# EAGLE design iot_inventory_mote (EAGLE 7.0.0)

## Sheet 1 of 2
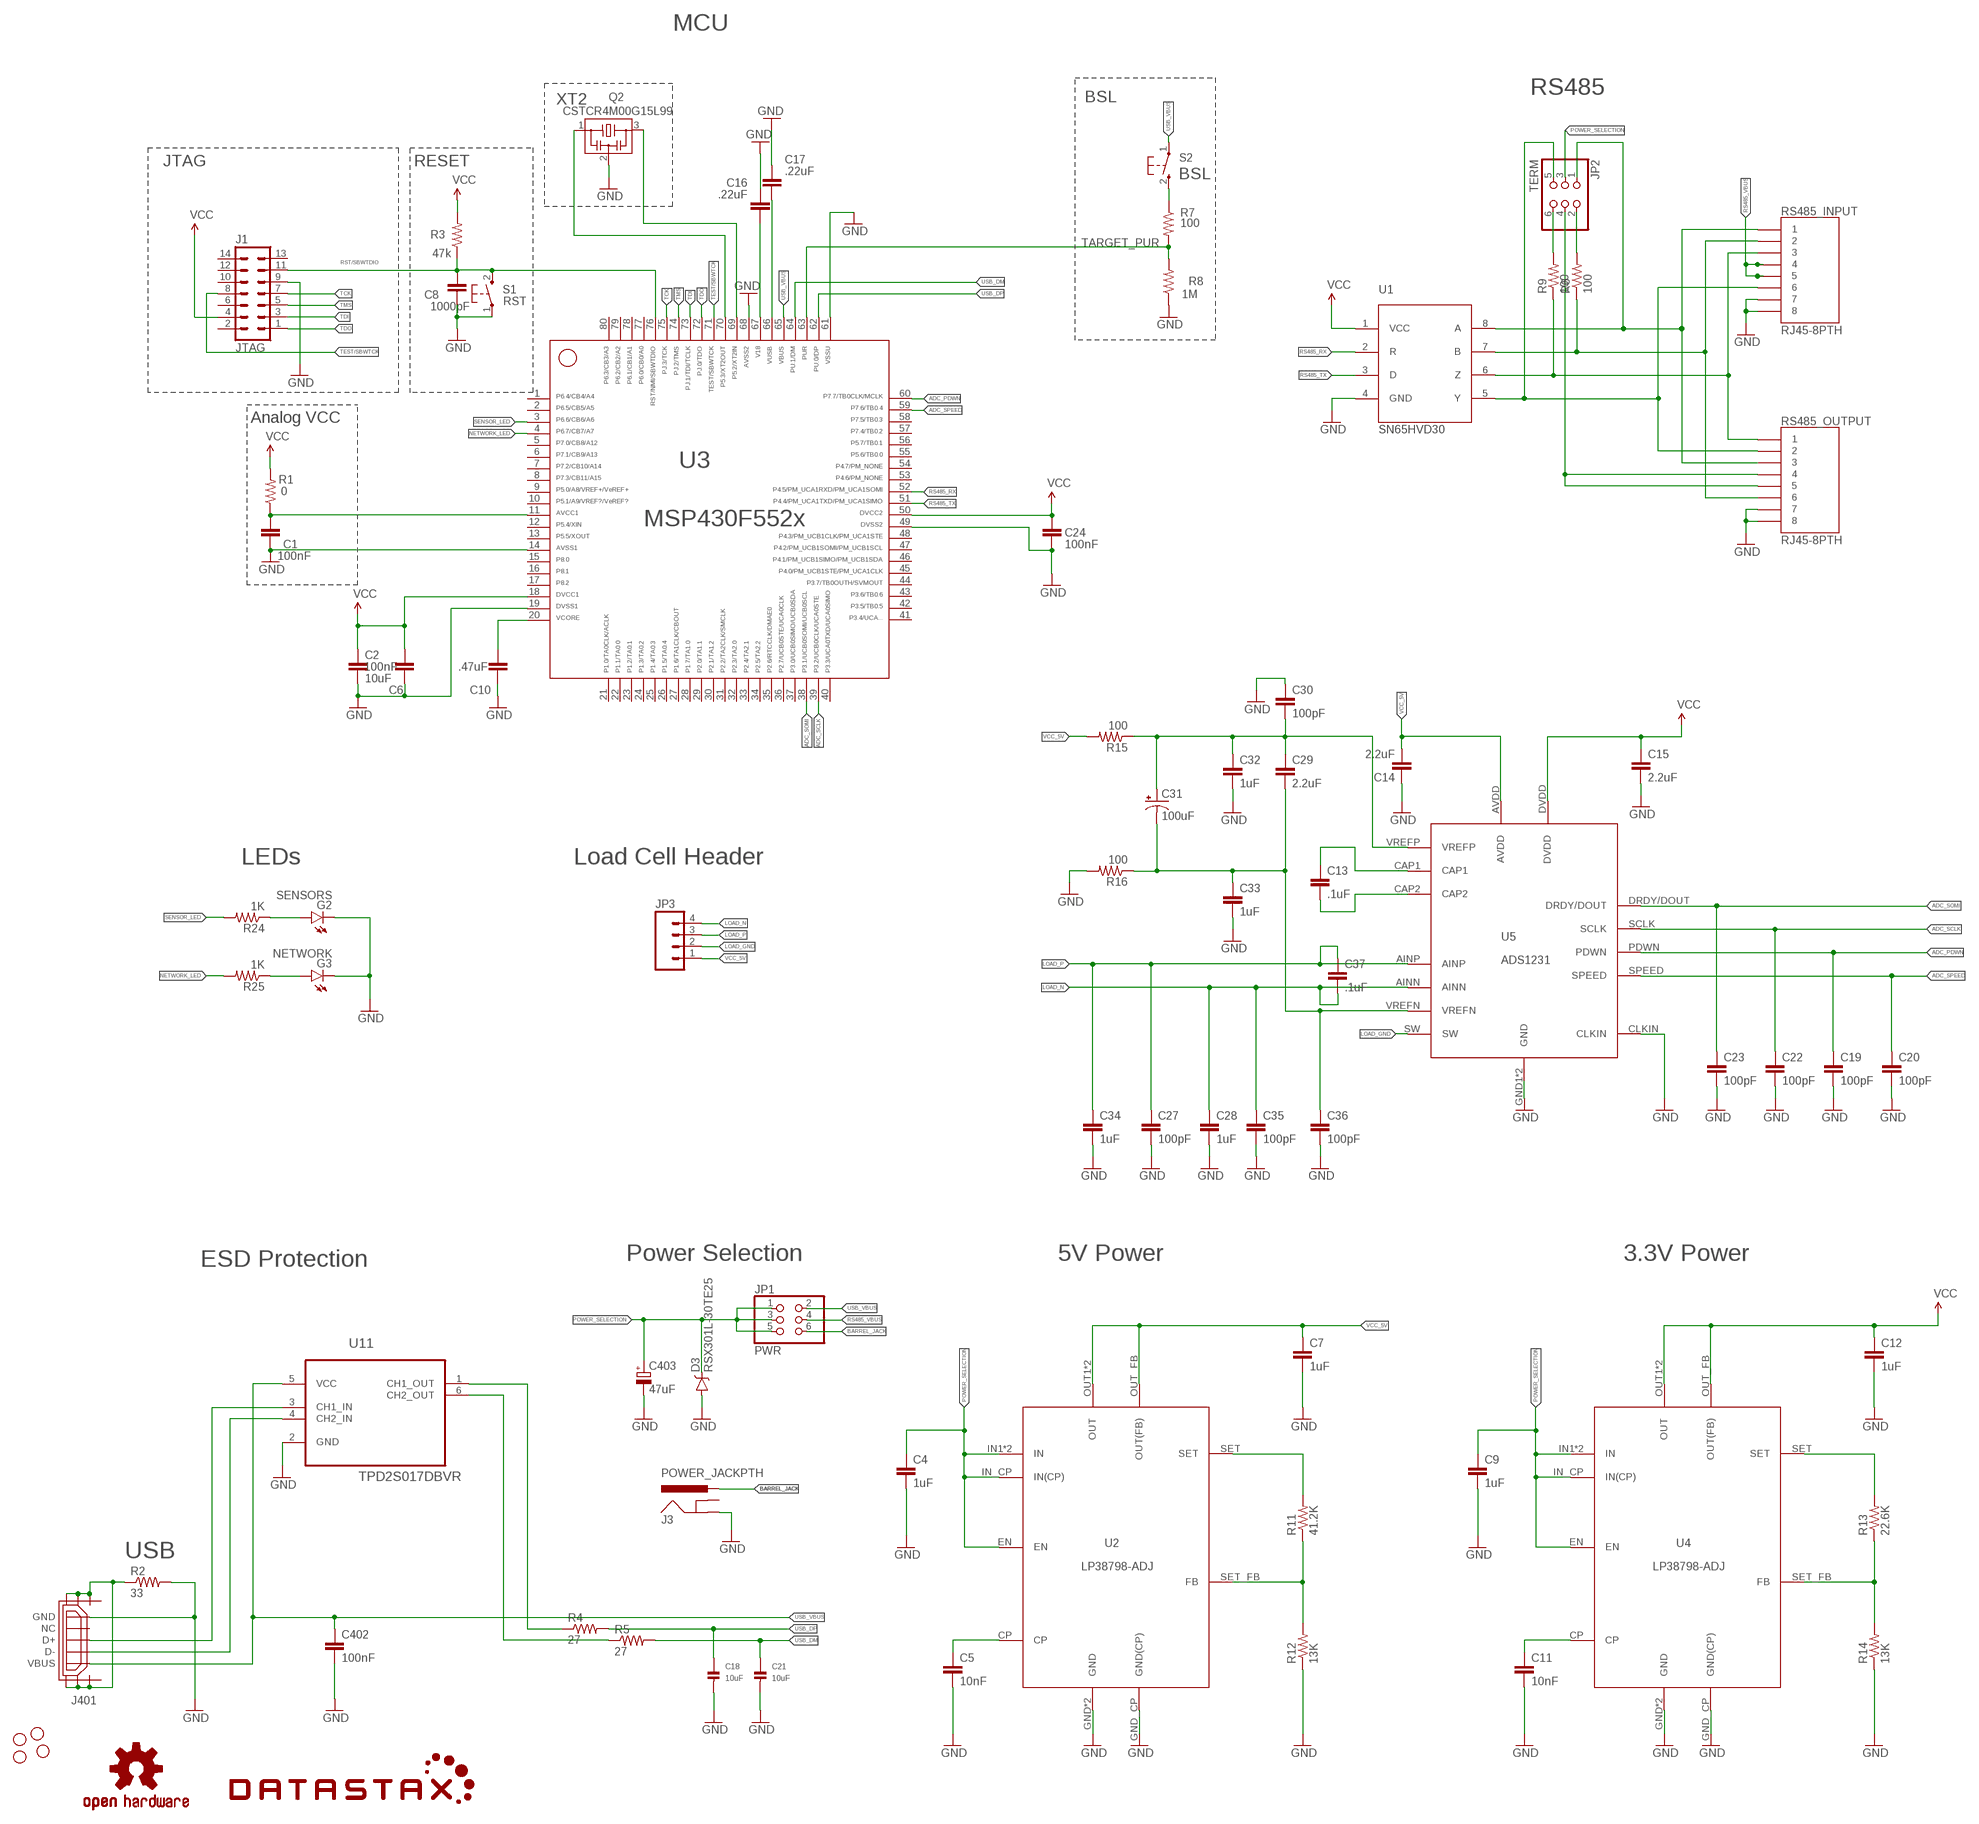
[diagram p0: schematic, sheet 1]

### Parts
C1  100nF  CAP0402-CAP  [0402-CAP]
C2  10uF  CAP0402-CAP  [0402-CAP]
C4  1uF  CAP0402-CAP  [0402-CAP]
C5  10nF  CAP0402-CAP  [0402-CAP]
C6  100nF  CAP0402-CAP  [0402-CAP]
C7  1uF  CAP0402-CAP  [0402-CAP]
C8  1000pF  CAP0402-CAP  [0402-CAP]
C9  1uF  CAP0402-CAP  [0402-CAP]
C10  .47uF  CAP0402-CAP  [0402-CAP]
C11  10nF  CAP0402-CAP  [0402-CAP]
C12  1uF  CAP0402-CAP  [0402-CAP]
C13  .1uF  CAP1210  [1210]
C14  2.2uF  CAP0402-CAP  [0402-CAP]
C15  2.2uF  CAP0402-CAP  [0402-CAP]
C16  .22uF  CAP0402-CAP  [0402-CAP]
C17  .22uF  CAP0402-CAP  [0402-CAP]
C18  10uF  CAP_CERAMIC0603  [0603]
C19  100pF  CAP0805  [0805]
C20  100pF  CAP0805  [0805]
C21  10uF  CAP_CERAMIC0603  [0603]
C22  100pF  CAP0805  [0805]
C23  100pF  CAP0805  [0805]
C24  100nF  CAP0402-CAP  [0402-CAP]
C27  100pF  CAP0603-CAP  [0603-CAP]
C28  1uF  CAP0805  [0805]
C29  2.2uF  CAP0402-CAP  [0402-CAP]
C30  100pF  CAP0603-CAP  [0603-CAP]
C31  100uF  CAP_POL7343  [EIA7343]
C32  1uF  CAP0805  [0805]
C33  1uF  CAP0805  [0805]
C34  1uF  CAP0805  [0805]
C35  100pF  CAP0603-CAP  [0603-CAP]
C36  100pF  CAP0603-CAP  [0603-CAP]
C37  .1uF  CAP1210  [1210]
C402  100nF  CAP0402-CAP  [0402-CAP]
C403  47uF  CPOL-EUA/3216-18R  [A/3216-18R]
D3  RSX301L-30TE25  MBRA140  [SMA-DIODE]
G2  SENSORS  LED0603  [LED-0603]
G3  NETWORK  LED0603  [LED-0603]
J1  JTAG  ML14  [ML14]
J3  POWER_JACKPTH  [POWER_JACK_PTH]
J401  USB_MICRO_FLIPPED  [HIROSE-ZX62R-B-5P]
JP1  PWR  PINHD-2X3  [2X03]
JP2  TERM  PINHD-2X3  [2X03]
JP3  M04SCREW  [SCREWTERMINAL-3.5MM-4]
LOGO1  OSHW-LOGOL  [OSHW-LOGO-L]
Q2  CSTCR4M00G15L99  MURATA-FILTER_CSTCR6M00G53Z  [MURATA-FILTER_CSTCR]
R1  0  R-US_R0402  [R0402]
R2  33  RESISTOR0402-RES  [0402-RES]
R3  47k  R-US_R0402  [R0402]
R4  27  RESISTOR0402-RES  [0402-RES]
R5  27  RESISTOR0402-RES  [0402-RES]
R6  100  RESISTOR0402-RES  [0402-RES]
R7  100  R-US_R0402  [R0402]
R8  1M  R-US_R0402  [R0402]
R9  100  RESISTOR0402-RES  [0402-RES]
R11  41.2K  RESISTOR0402-RES  [0402-RES]
R12  13K  RESISTOR0402-RES  [0402-RES]
R13  22.6K  RESISTOR0402-RES  [0402-RES]
R14  13K  RESISTOR0402-RES  [0402-RES]
R15  100  RESISTOR0402-RES  [0402-RES]
R16  100  RESISTOR0402-RES  [0402-RES]
R24  1K  RESISTOR0402-RES  [0402-RES]
R25  1K  RESISTOR0402-RES  [0402-RES]
RS485_INPUT  RJ45-8PTH  [RJ45-8]
RS485_OUTPUT  RJ45-8PTH  [RJ45-8]
S1  RST  PB  [PBTH]
S2  BSL  PB  [PBTH]
STANDOFF1  STAND-OFF  [STAND-OFF]
STANDOFF2  STAND-OFF  [STAND-OFF]
STANDOFF3  STAND-OFF  [STAND-OFF]
STANDOFF4  STAND-OFF  [STAND-OFF]
U1  SN65HVD30  [SOIC8]
U2  LP38798-ADJ  [WSON12]
U3  MSP430F5529IPNR  F552X---PN80  [PN80]
U4  LP38798-ADJ  [WSON12]
U5  ADS1231  [ADS1231]
U11  TPD2S017DBVR  [SOT95P280X145-6N]
U$1  DATASTAX_LOGO  [DATASTAX_LOGO]

### Nets
ADC_PDWN: C19.1 U3.60 U5.PDWN
ADC_SCLK: C22.1 U3.39 U5.SCLK
ADC_SOMI: C23.1 U3.38 U5.DRDY/DOUT
ADC_SPEED: C20.1 U3.59 U5.SPEED
AVCC [Power]: C1.1 R1.1 U3.11
BARREL_JACK: J3.PWR JP1.6
GND [Ground]: C1.2 C2.2 C4.2 C5.2 C6.2 C7.2 C8.2 C9.2 C10.2 C11.2 C12.2 C14.1 C15.2 C16.2 C17.2 C18.2 C19.2 C20.2 C21.2 C22.2 C23.2 C24.2 C27.2 C28.2 C30.1 C32.2 C33.2 C34.2 C35.2 C36.2 C402.2 C403.- D3.A G2.C G3.C J1.9 J3.GND J401.GND Q2.2 R2.2 R8.1 R12.1 R14.1 R16.2 RS485_INPUT.7 RS485_INPUT.8 RS485_OUTPUT.7 RS485_OUTPUT.8 S1.1(P) U1.4(GND) U2.GND U2.GND_CP(GND(CP)) U2.GPAD(GND) U3.14 U3.19 U3.49 U3.61 U3.68 U4.GND U4.GND_CP(GND(CP)) U4.GPAD(GND) U5.CLKIN U5.GND1(GND) U5.GND2(GND) U11.2(GND)
LOAD_GND: JP3.2 U5.SW
LOAD_N: C28.1 C35.1 C37.2 JP3.4 U5.AINN
LOAD_P: C27.1 C34.1 C37.1 JP3.3 U5.AINP
N$1: JP2.2 R6.2
N$3: R6.1 RS485_INPUT.2 RS485_OUTPUT.6 U1.7(B)
N$4: R9.1 RS485_INPUT.3 RS485_OUTPUT.1 U1.6(Z)
N$5: JP2.1 RS485_INPUT.1 RS485_OUTPUT.3 U1.8(A)
N$6: G3.A R25.1
N$7: JP2.6 R9.2
N$8: JP2.5 RS485_INPUT.6 RS485_OUTPUT.2 U1.5(Y)
N$9: R13.2 U4.SET
N$10: J401.D+ U11.3(CH1_IN)
N$11 [Ground]: R11.1 R12.2 U2.SET_FB(FB)
N$12: R11.2 U2.SET
N$13: C5.1 U2.CP
N$14: J401.D- U11.4(CH2_IN)
N$15 [Ground]: R13.1 R14.2 U4.SET_FB(FB)
N$16: C11.1 U4.CP
N$17: C13.1 U5.CAP1
N$18: C13.2 U5.CAP2
N$19: G2.A R24.1
N$20: J401.SHIELD1 J401.SHIELD2 J401.SHIELD3 J401.SHIELD4 J401.SHIELD5 J401.SHIELD6 R2.1
N$32: C29.1 C30.2 C31.A(+) C32.1 R15.1 U5.VREFP
N$38: R7.1 S2.2(S)
N$42: R5.1 U11.6(CH2_OUT)
N$43: R4.1 U11.1(CH1_OUT)
N$78: C29.2 C31.C(-) C33.1 C36.1 R16.1 U5.VREFN
N$89: JP2.4 RS485_OUTPUT.4 RS485_OUTPUT.5
NETWORK_LED: R25.2 U3.4
P5.2/XT2IN: Q2.3 U3.69
P5.3/XT2OUT: Q2.1 U3.70
POWER_SELECTION: C4.1 C9.1 C403.+ D3.C JP1.1 JP1.3 JP1.5 JP2.3 U2.EN U2.IN1(IN) U2.IN2(IN) U2.IN_CP(IN(CP)) U4.EN U4.IN1(IN) U4.IN2(IN) U4.IN_CP(IN(CP))
RS485_RX: U1.2(R) U3.52
RS485_TX: U1.3(D) U3.51
RS485_VBUS: JP1.4 RS485_INPUT.4 RS485_INPUT.5
RST/SBWTDIO: C8.1 J1.11 R3.1 S1.2(S) U3.76
SENSOR_LED: R24.2 U3.3
TARGET_PUR: R7.2 R8.2 U3.63
TARGET_VUSB [Power]: C17.1 U3.66
TCK: J1.7 U3.75
TDI: J1.3 U3.73
TDO: J1.1 U3.72
TEST/SBWTCK: J1.8 U3.71
TMS: J1.5 U3.74
USB_DM: C21.1 R5.2 U3.64
USB_DP: C18.1 R4.2 U3.62
USB_VBUS: C402.1 J401.VBUS JP1.2 S2.1(P) U3.65 U11.5(VCC)
V18 [Power]: C16.1 U3.67
VCC [Power]: C2.1 C6.1 C12.1 C15.1 C24.1 J1.4 R1.2 R3.2 U1.1(VCC) U3.18 U3.50 U4.OUT1(OUT) U4.OUT2(OUT) U4.OUT_FB(OUT(FB)) U5.DVDD
VCC_5V: C7.1 C14.2 JP3.1 R15.2 U2.OUT1(OUT) U2.OUT2(OUT) U2.OUT_FB(OUT(FB)) U5.AVDD
VCORE [Power]: C10.1 U3.20
Unconnected: J1.2 J1.6 J1.10 J1.12 J1.13 J1.14 J3.GNDBREAK J401.NC U3.1 U3.2 U3.5 U3.6 U3.7 U3.8 U3.9 U3.10 U3.12 U3.13 U3.15 U3.16 U3.17 U3.21 U3.22 U3.23 U3.24 U3.25 U3.26 U3.27 U3.28 U3.29 U3.30 U3.31 U3.32 U3.33 U3.34 U3.35 U3.36 U3.37 U3.40 U3.41 U3.42 U3.43 U3.44 U3.45 U3.46 U3.47 U3.48 U3.53 U3.54 U3.55 U3.56 U3.57 U3.58 U3.77 U3.78 U3.79 U3.80

### Notes on the sheet
- MCU
- RS485
- XT2 | BSL
- JTAG | RESET
- /Users/mstump/Downloads/datastax_logo_black.bmp
- Analog VCC
- LEDs | Load Cell Header
- ESD Protection | Power Selection | 5V Power | 3.3V Power
- USB

## Sheet 2 of 2

## Library data of the parts
C1 C6 C24 = SparkFun-Capacitors:CAP: Capacitor Standard 0603 ceramic capacitor, and 0.1" leaded capacitor.; OC_DIGIKEY: 445-4984-1-ND
C2 = SparkFun-Capacitors:CAP: Capacitor Standard 0603 ceramic capacitor, and 0.1" leaded capacitor.; OC_DIGIKEY: 1276-1450-1-ND
C4 C7 C9 C12 = SparkFun-Capacitors:CAP: Capacitor Standard 0603 ceramic capacitor, and 0.1" leaded capacitor.; OC_DIGIKEY: 445-4978-1-ND
C5 C11 = SparkFun-Capacitors:CAP: Capacitor Standard 0603 ceramic capacitor, and 0.1" leaded capacitor.; OC_DIGIKEY: 490-1312-1-ND
C8 = SparkFun-Capacitors:CAP: Capacitor Standard 0603 ceramic capacitor, and 0.1" leaded capacitor.; MF: TDK; MPN: C1005X7R1H102K050BA; OC_DIGIKEY: 445-1256-1-ND; OC_NEWARK: unknown
C10 = SparkFun-Capacitors:CAP: Capacitor Standard 0603 ceramic capacitor, and 0.1" leaded capacitor.; OC_DIGIKEY: 445-13864-1-ND
C13 C37 = SparkFun-Capacitors:CAP: Capacitor Standard 0603 ceramic capacitor, and 0.1" leaded capacitor.; OC_DIGIKEY: PCF1189CT-ND; OC_NEWARK: unknown
C14 C15 = SparkFun-Capacitors:CAP: Capacitor Standard 0603 ceramic capacitor, and 0.1" leaded capacitor.; OC_DIGIKEY: 490-3091-1-ND
C16 C17 = SparkFun-Capacitors:CAP: Capacitor Standard 0603 ceramic capacitor, and 0.1" leaded capacitor.; OC_DIGIKEY: 445-4972-1-ND; OC_NEWARK: unknown
C18 C21 = microbuilder:CAP_CERAMIC: Ceramic Capacitors 0402 - 0402 Surface Mount Capacitors 16pF 50V 5% [Digikey: 445-4899-2-ND] 18pF 50V 5% [Digikey: 490-1281-2-ND] 22pF 50V 5% [Digikey: 490-1283-2-ND] 68pF 50V 5% [Digikey: 490-1289-2-ND] 0.1uF 10V 10% [Digikey: 490-1318-2-ND] 1.0uF 6.3V 10% [Digikey: 490-1320-2-ND] 0603 - 0603 Surface Mount Capacitors 16 pF 50V 5% [Digikey: 445-5051-2-ND] 22 pF 50V [Digikey: PCC220ACVTR-ND] 33 pF 50V 5% [Digikey: 490-1415-1-ND] 56pF 50V 5% [Digikey: 490-1421-1-ND] 220pF 50V 5% [Digikey: 445-1285-1-ND] 680 pF 50V 2200 pF 50V 5% C0G [Digikey: 445-1297-1-ND] 5600 pF 100V 5% X7R [Digikey: 478-3711-1-ND] 0.1 µF 25V 10% [Digikey: PCC2277TR-ND] 0.22 µF 16V 10% X7R [Digikey: 445-1318-1-ND] 1.0 µF 25V 10% [Digikey: 445-5146-2-ND] 0603 - RF Specific 3pF 250V +/-0.1pF RF [Digikey: 712-1347-1-ND] 18 pF 250V 5% [Digikey: 478-3505-1-ND or 712-1322-1-ND] 56 pF 250V 5% C0G RF [Digikey: 490-4867-1-ND] 68 pF 250V RF [Digikey: 490-4868-1-ND] 0805 - 0805 Surface Mount Capacitors 220 pF 250V 2% RF Ceramic Capacitor [Digikey: 712-1398-1-ND] 1000 pF 50V 2% NP0 Ceramic Capacitor [Digikey: 478-3760-1-ND] 0.1 µF 25V 10% Ceramic Capacitor [Digikey: PCC1828TR-ND] 1.0 µF 16V 10% Ceramic Capacitor[Digikey: 490-1691-2-ND] 10.0 µF 10V 10% Ceramic Capacitor[Digikey: 709-1228-1-ND] 10.0 uF 16V 10% Ceramic Capacitor [Digikey: 478-5165-2-ND] 47 uF 6.3V 20% Ceramic Capacitor [Digikey: 587-1779-1-ND or 399-5506-1-ND] 1206 - 1206 Surface Mount Capacitors 47uF 10V 20% Ceramic Capacitor [Digikey: 490-5528-1-ND or 399-5508-1-ND or 445-6010-1-ND] 100uF 6.3V -20%, +80% Y5V Ceramic Capacitor (Digikey: 490-4512-1-ND, Mouser: 81-GRM31CF50J107ZE1L); MPN: 06035A100FAT2A; OC_DIGIKEY: 490-7198-1-ND
C19 C20 C22 C23 = SparkFun-Capacitors:CAP: Capacitor Standard 0603 ceramic capacitor, and 0.1" leaded capacitor.; OC_DIGIKEY: 490-2534-1-ND; OC_NEWARK: unknown
C27 C30 C35 C36 = SparkFun-Capacitors:CAP: Capacitor Standard 0603 ceramic capacitor, and 0.1" leaded capacitor.; OC_DIGIKEY: PCF1441CT-ND; OC_NEWARK: unknown
C28 C32-C34 = SparkFun-Capacitors:CAP: Capacitor Standard 0603 ceramic capacitor, and 0.1" leaded capacitor.; OC_DIGIKEY: 490-3912-1-ND; OC_NEWARK: unknown
C29 = SparkFun-Capacitors:CAP: Capacitor Standard 0603 ceramic capacitor, and 0.1" leaded capacitor.; OC_DIGIKEY: 490-3091-1-ND; OC_NEWARK: unknown
C31 = SparkFun-Passives:CAP_POL: Capacitor Polarized These are standard SMD and PTH capacitors. Normally 10uF, 47uF, and 100uF in electrolytic and tantalum varieties. Always verify the external diameter of the through hole cap, it varies with capacity, voltage, and manufacturer. The EIA devices should be standard.; OC_DIGIKEY: 399-3853-1-ND
C402 = SparkFun-Capacitors:CAP: Capacitor Standard 0603 ceramic capacitor, and 0.1" leaded capacitor.; MPN: 100NA100MEFC12.5X25; OC_DIGIKEY: 445-4984-1-ND
C403 = rcl:CPOL-EU: POLARIZED CAPACITOR, European symbol; OC_DIGIKEY: 478-8225-1-ND
D3 = SparkFun-DiscreteSemi:MBRA140: 40V, 1A Schottky rectifier SMA/DO-214AC package DIO-08053; OC_DIGIKEY: RSX301L-30TE25CT-ND; PROD_ID: DIO-08053
G2 = SparkFun-LED:LED: LEDs Standard schematic elements and footprints for 5mm, 3mm, 1206, and 0603 sized LEDs. 5mm - Spark Fun Electronics SKU : COM-00529 (and others); OC_DIGIKEY: LNJ937W8CRACT-ND; OC_NEWARK: unknown
G3 = SparkFun-LED:LED: LEDs Standard schematic elements and footprints for 5mm, 3mm, 1206, and 0603 sized LEDs. 5mm - Spark Fun Electronics SKU : COM-00529 (and others); OC_DIGIKEY: 1516-1057-1-ND; OC_NEWARK: unknown
J1 = CON-ML:ML14: HARTING; MF: SULLINS; MPN: SBH11-PBPC-D07-ST-BK; OC_DIGIKEY: S9170-ND; OC_FARNELL: unknown; OC_NEWARK: unknown
J3 = SparkFun-Connectors:POWER_JACK: Power Jack This is the standard 5.5mm barrel jack for power. The PTH is the most common, proven, reliable, footprint. The Slot footprint only works if the mill layer is transmitted to the PCB fab house so be warned. Mating wall wart : TOL-00298 (and others); OC_DIGIKEY: CP-102BH-ND; PROD_ID: PRT-00119
J401 = usb_con-update:USB_MICRO_FLIPPED; MF: HIROSE; MPN: ZX62R-B-5P; OC_DIGIKEY: H11574CT-ND
JP1 = SparkFun-Connectors:PINHD-2X3: PIN HEADER; OC_DIGIKEY: 609-3210-ND
JP2 = SparkFun-Connectors:PINHD-2X3: PIN HEADER; OC_DIGIKEY: 609-3210-ND; OC_NEWARK: unknown
JP3 = SparkFun-Connectors:M04: Header 4 Standard 4-pin 0.1" header. Use with straight break away headers (SKU : PRT-00116), right angle break away headers (PRT-00553), swiss pins (PRT-00743), machine pins (PRT-00117), and female headers (PRT-00115). Molex polarized connector foot print use with SKU : PRT-08231 with associated crimp pins and housings. 1MM SMD Version SKU: PRT-10208; OC_DIGIKEY: ED1516-ND; OC_NEWARK: unknown
LOGO1 = SparkFun-Aesthetics:OSHW-LOGO: Open Source Hardware Logo This logo indicates the piece of hardware it is found on incorporates a OSHW license and/or adheres to the definition of open source hardware found here: http://freedomdefined.org/OSHW; OC_NEWARK: unknown
Q2 = murata:MURATA-FILTER_CSTCR: Resonator Source: murata.co.jp; MF: MURATA; MPN: CSTCR6M00G53-R0; OC_DIGIKEY: 490-1204-1-ND; OC_FARNELL: 1170434; OC_NEWARK: 25M8759
R1 = adafruit:R-US_: RESISTOR, American symbol; OC_DIGIKEY: P0.0JCT-ND
R2 = SparkFun-Passives:RESISTOR: Resistor Basic schematic elements and footprints for 0603, 1206, and PTH resistors.; OC_DIGIKEY: 311-33JRCT-ND
R3 = adafruit:R-US_: RESISTOR, American symbol; MF: PANASONIC; MPN: ERJ-2RKF4702X; OC_DIGIKEY: P47.0KLCT-ND; OC_NEWARK: unknown
R4 R5 = SparkFun-Passives:RESISTOR: Resistor Basic schematic elements and footprints for 0603, 1206, and PTH resistors.; OC_DIGIKEY: P27.0LCT-ND
R6 R9 R15 R16 = SparkFun-Passives:RESISTOR: Resistor Basic schematic elements and footprints for 0603, 1206, and PTH resistors.; OC_DIGIKEY: P100LCT-ND; OC_NEWARK: unknown
R7 = adafruit:R-US_: RESISTOR, American symbol; OC_DIGIKEY: P100LCT-ND
R8 = adafruit:R-US_: RESISTOR, American symbol; OC_DIGIKEY: P1.00MLCT-ND
R11 = SparkFun-Passives:RESISTOR: Resistor Basic schematic elements and footprints for 0603, 1206, and PTH resistors.; OC_DIGIKEY: P41.2KLCT-ND
R12 R14 = SparkFun-Passives:RESISTOR: Resistor Basic schematic elements and footprints for 0603, 1206, and PTH resistors.; OC_DIGIKEY: P13.0KLCT-ND
R13 = SparkFun-Passives:RESISTOR: Resistor Basic schematic elements and footprints for 0603, 1206, and PTH resistors.; OC_DIGIKEY: P22.6KLCT-ND
R24 = SparkFun-Passives:RESISTOR: Resistor Basic schematic elements and footprints for 0603, 1206, and PTH resistors.; MF: PANASONIC; MPN: ERJ-2RKF1001X; OC_DIGIKEY: P1.00KLCT-ND
R25 = SparkFun-Passives:RESISTOR: Resistor Basic schematic elements and footprints for 0603, 1206, and PTH resistors.; MF: PANASONIC; MPN: ERJ-2RKF1001X; OC_DIGIKEY: P1.00KLCT-ND; OC_NEWARK: unknown
RS485_INPUT RS485_OUTPUT = SparkFun-Connectors:RJ45-8: RJ45 Jack Simple RJ45, 8-pin connection - connector for common Cat5, Cat5e, and Cat6 Ethernet cables. Footprint not yet proven in production. Connector sku is PRT-00643; Breakout PCB sku is BOB-00716.; MF: FCI; MPN: 54602-908LF; OC_DIGIKEY: 609-1046-ND; OC_NEWARK: unknown
S1 = electricalmeter:PB: OMRON SWITCH; MF: PANASONIC; MPN: EVQ-11L05R; OC_DIGIKEY: P8079SCT-ND; OC_NEWARK: unknown
S2 = electricalmeter:PB: OMRON SWITCH; OC_DIGIKEY: P8079SCT-ND
STANDOFF1-STANDOFF4 = SparkFun-Electromechanical:STAND-OFF: #4 Stand Off This is the mechanical footprint for a #4 phillips button head screw. Use the keepout ring to avoid running the screw head into surrounding components. SKU : PRT-00447; OC_NEWARK: unknown
U1 = iot_demo_hardware:SN65HVD30; MF: TI; MPN: SN65HVD3082EDR; OC_DIGIKEY: 296-31719-1-ND; OC_NEWARK: unknown
U2 U4 = iot_demo_hardware:LP38798-ADJ; MF: TI; MPN: LP38798SD-ADJ/NOPB; OC_DIGIKEY: 296-35855-1-ND
U3 = TI_MSP430_v16_intern:F552X---PN80: ***MSP430F552X***PN80 http://www.ti.com/lit/gpn/msp430f5529 Rev1.0 06/2010 For F552X where X is 1,5,7,9; MF: TI; MPN: MSP430F5529IPNR; OC_DIGIKEY: 296-27306-1-ND
U5 = iot_demo_hardware:ADS1231; MF: TI; MPN: ADS1231ID; OC_DIGIKEY: 296-28140-5-ND
U11 = Texas Instruments_By_element14_Batch_1:TPD2S017DBVR: 2-CHANNEL ULTRA-LOW CLAMP VOLTAGE ESD SOLUTION WITH SERIES-RESISTOR ISOLATION; MF: TI; MPN: TPD2S017DBVR; OC_DIGIKEY: 296-25216-1-ND; OC_FARNELL: -; OC_NEWARK: 50R8094; PACKAGE: SOT-23-6; SUPPLIER: Texas Instruments
U$1 = datastax:DATASTAX_LOGO; OC_NEWARK: unknown

## Net classes
1 Ground: width 0.203 mm, drill 0.305 mm, clearance 0.152 mm to class 0, clearance 0.152 mm
2 Power: width 0.203 mm, drill 0.305 mm, clearance 0.152 mm to class 0, clearance 0.152 mm to class 1, clearance 0.152 mm

## Board
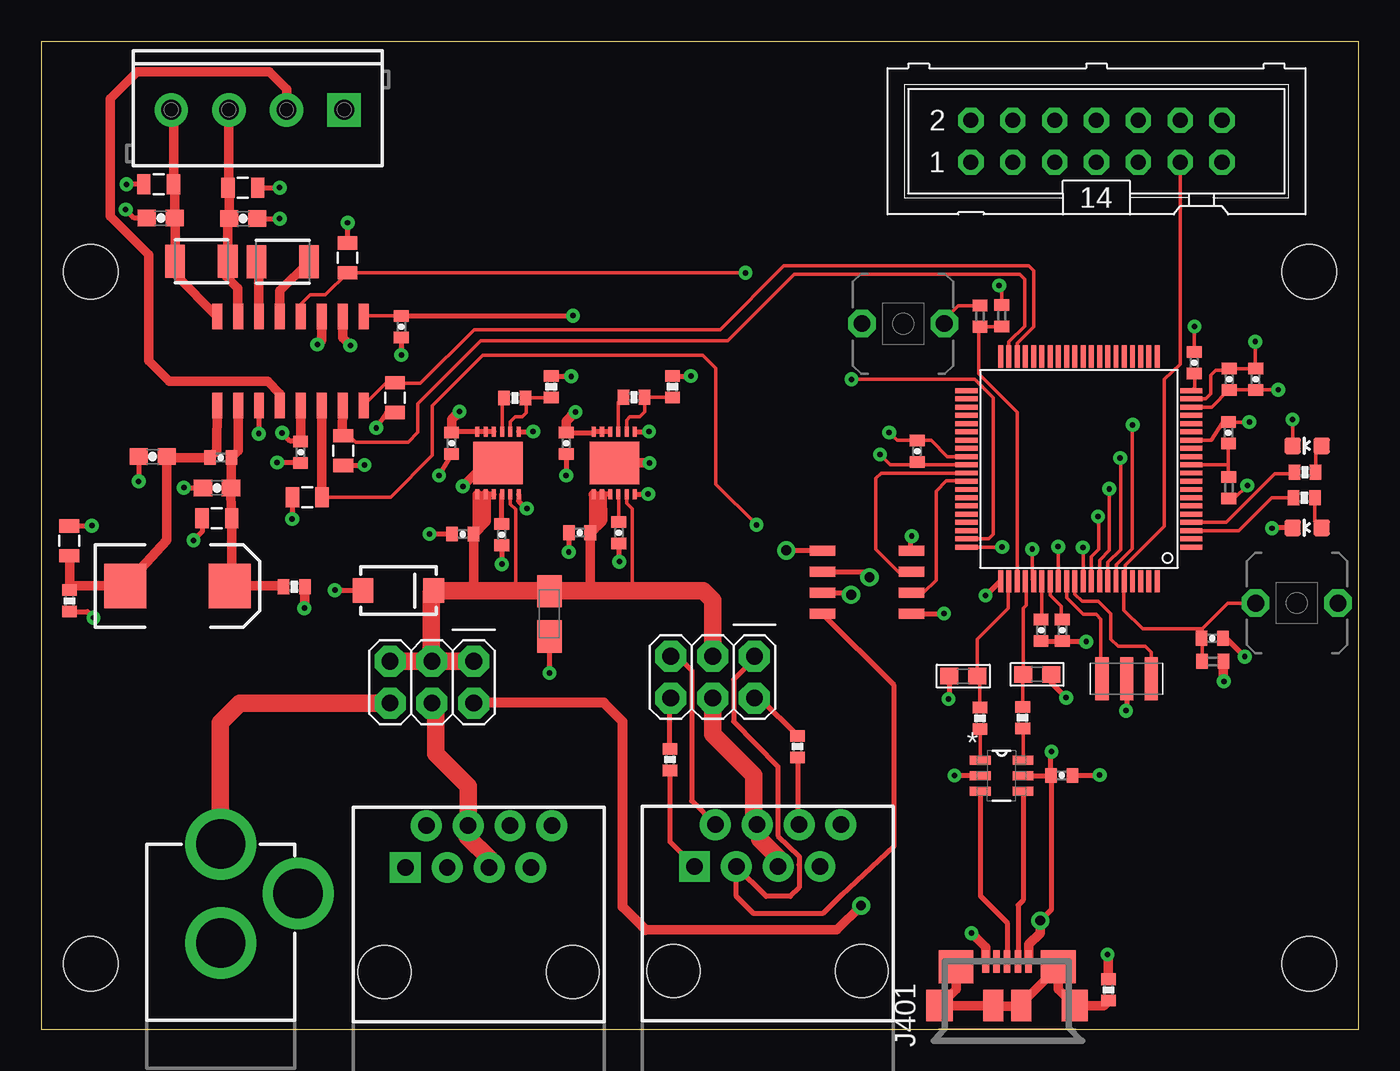
[diagram p1: board, top side]
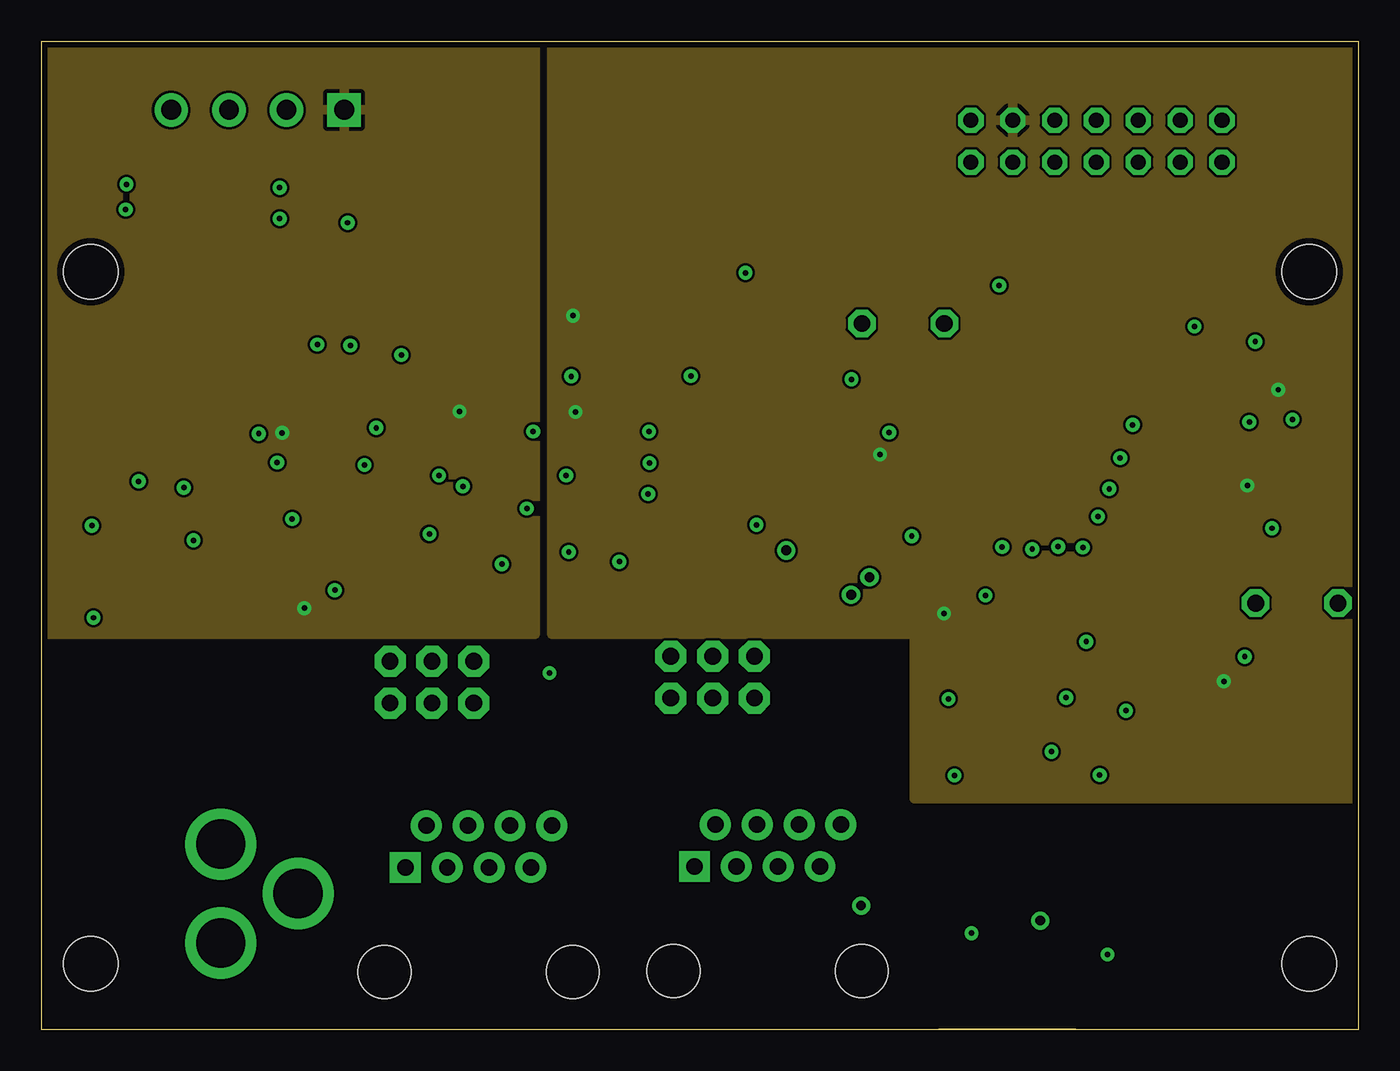
[diagram p2: board, inner layer Route2]
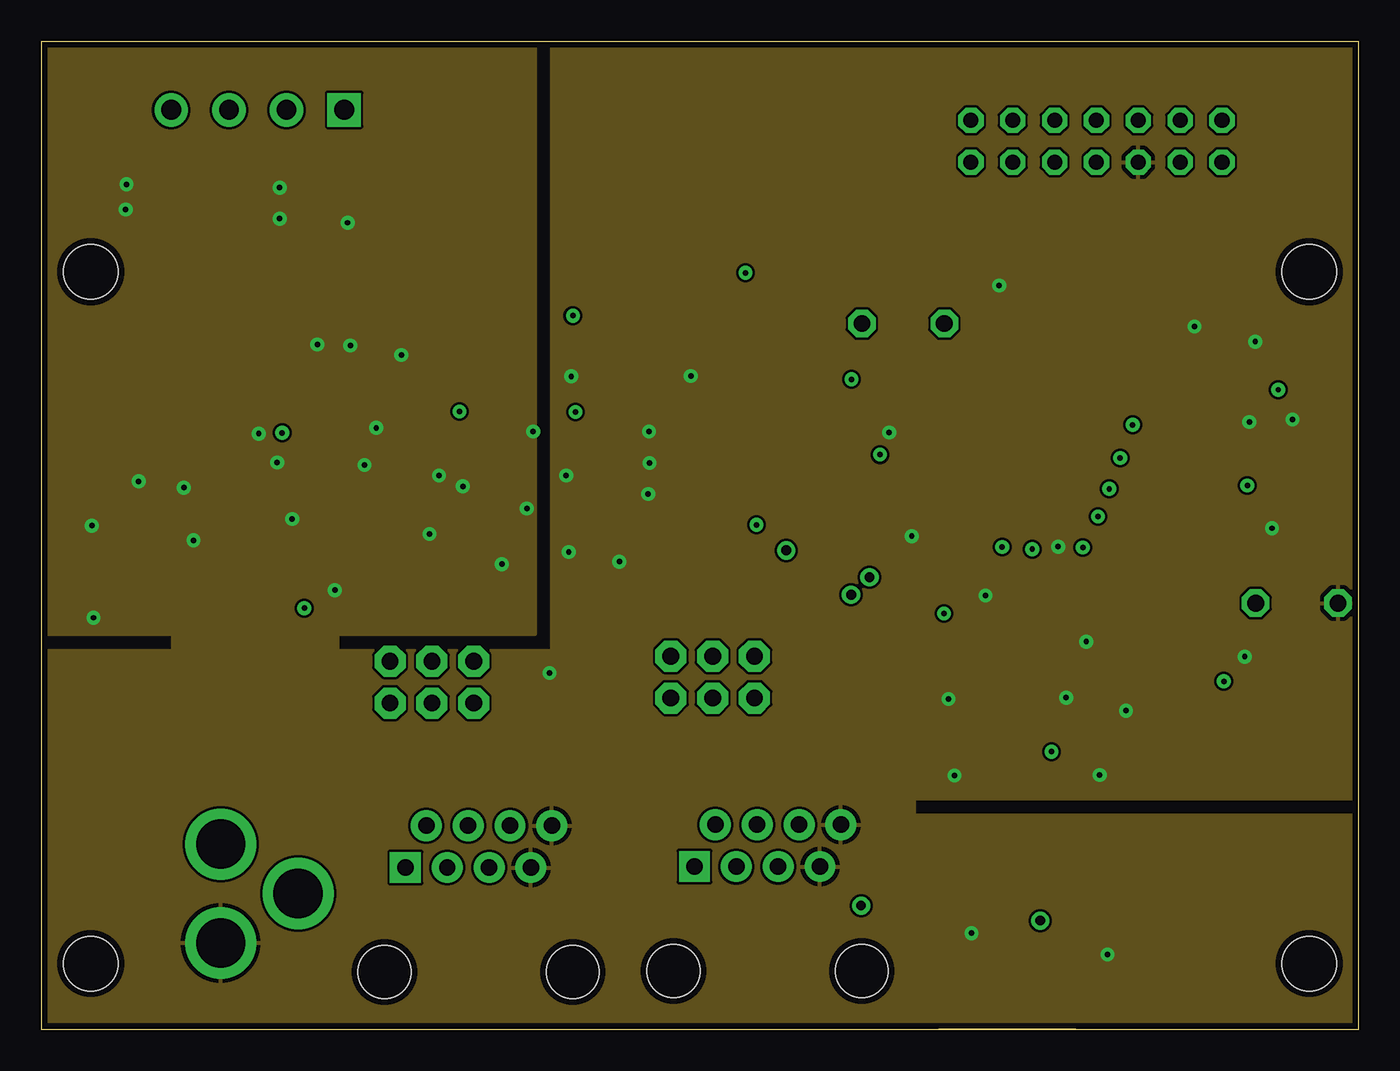
[diagram p3: board, inner layer Route15]
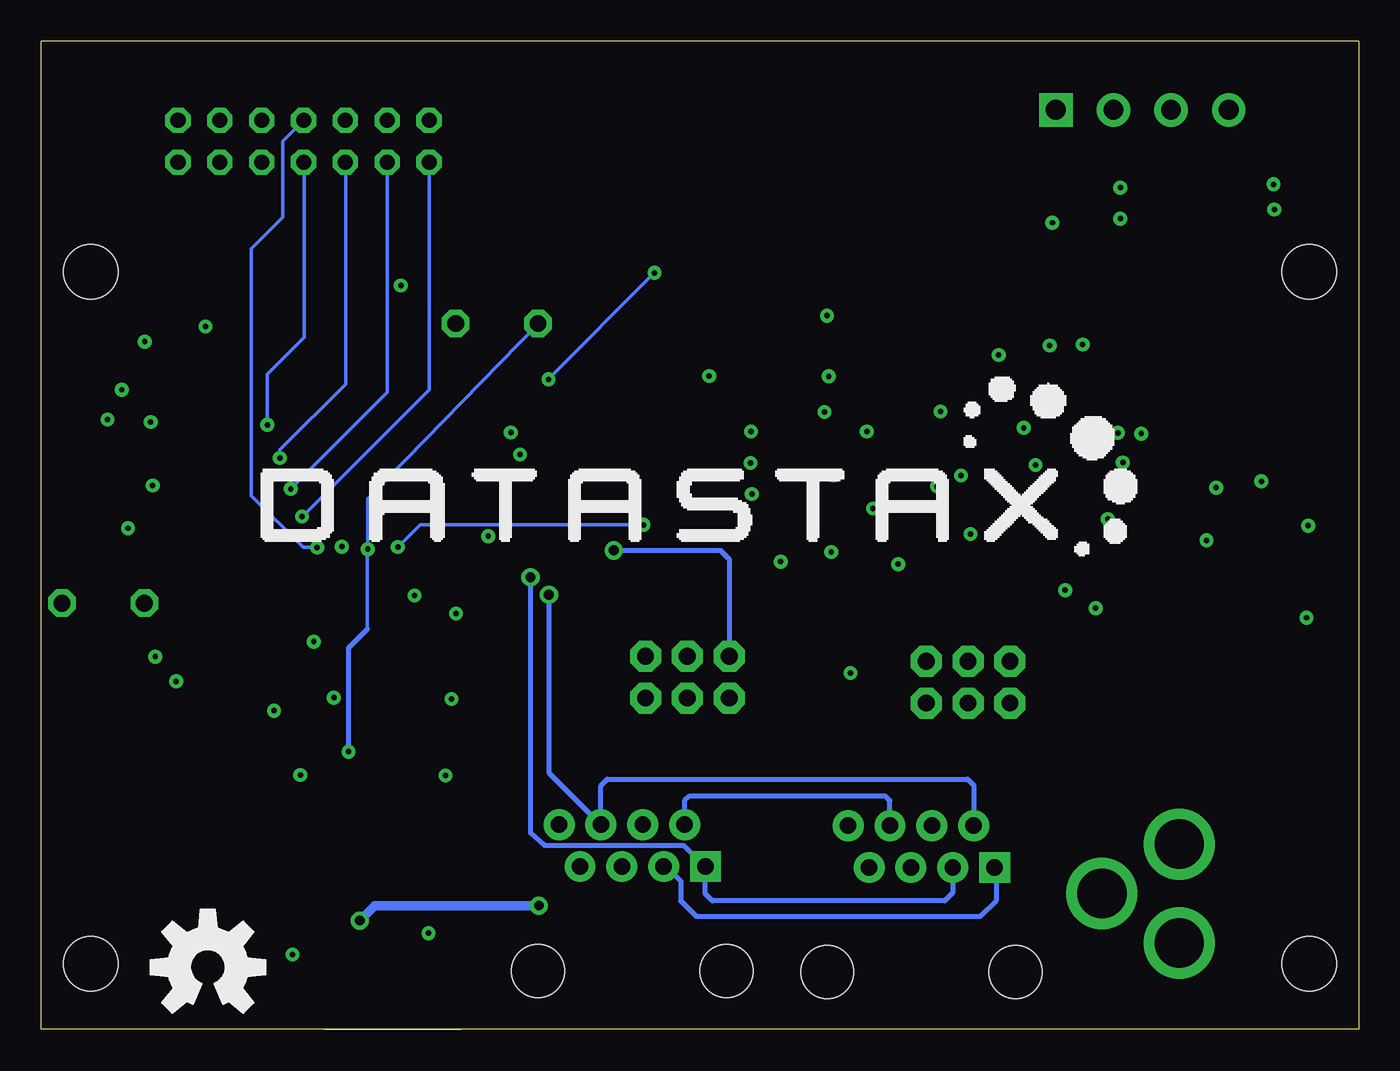
[diagram p4: board, bottom side, seen from below]

Size 80 x 60 mm. Coordinates in mm from the lower left corner, seen from the top.
Outline: 0,0 80,0 80,60 0,60 0,0
Copper layers (1+2*15+16): Top 0.0356mm / dielectric 1.5011mm / Route2 0.0356mm / dielectric 0.1499mm / Route15 0.0356mm / dielectric 0.2007mm / Bottom 0.0356mm
Design rules "LaenPCBOrder *": minimum track width 6mil, minimum drill 13mil, track to track 6mil, track to pad 6mil, pad to pad 6mil, via to via 6mil, smd to smd 6mil, copper to edge 15mil, drill to drill 6mil, minimum pad ring 12mil, minimum via ring 10mil, stop-mask expansion 3mil, vias tented up to drill 0mil, thermal gap 10mil

### Footprints (pad centres in the part's own frame; a part is rotated, then mirrored left to right if it is on the bottom)
0402-CAP = smd 0.7 x 0.9: 1 -0.65,0; 2 0.65,0
1210 = smd 1.2 x 2: 1 -1.6,0; 2 1.6,0
0603 = smd 1.1 x 1: 1 -0.85,0; 2 0.85,0
0805 = smd 0.8 x 1.2: 1 -0.9,0; 2 0.9,0
0603-CAP = smd 1.1 x 1: 1 -0.85,0; 2 0.85,0
EIA7343 = smd 2.55 x 2.7: A 3.17,0; C -3.17,0
A/3216-18R = smd 1.95 x 1.5: + 1.375,0; - -1.375,0
SMA-DIODE = smd 1.27 x 1.47: A -2.15,0; C 2.15,0
LED-0603 = smd 1 x 1: A 0,-0.877; C 0,0.877
ML14 = drill 0.914 octagon: 1 -7.62,-1.27; 2 -7.62,1.27; 3 -5.08,-1.27; 4 -5.08,1.27; 5 -2.54,-1.27; 6 -2.54,1.27; 7 0,-1.27; 8 0,1.27; 9 2.54,-1.27; 10 2.54,1.27; 11 5.08,-1.27; 12 5.08,1.27; 13 7.62,-1.27; 14 7.62,1.27
POWER_JACK_PTH = drill 2.997 pad 4.318: GND 0,7.7; GNDBREAK 4.7,10.7; PWR 0,13.7
HIROSE-ZX62R-B-5P = smd 1.35 x 0.4: D+ 2.675,0; D- 2.675,-0.65; GND 2.675,1.3; NC 2.675,0.65; VBUS 2.675,-1.3 | smd 1.9 x 1.6: SHIELD1 0,4.1; SHIELD2 0,-4.1 | smd 2 x 2.1: SHIELD3 2.35,3.1; SHIELD4 2.35,-3.1 | smd 1.9 x 1.2: SHIELD5 0,0.85; SHIELD6 0,-0.85
2X03 = drill 1.016 pad 1.88 octagon: 1 -2.54,-1.27; 2 -2.54,1.27; 3 0,-1.27; 4 0,1.27; 5 2.54,-1.27; 6 2.54,1.27
SCREWTERMINAL-3.5MM-4 = drill 1.2 pad 2.032 square: 1 0,0 | drill 1.2 pad 2.032: 2 3.5,0; 3 7,0; 4 10.5,0
MURATA-FILTER_CSTCR = smd 0.8 x 2.6: 1 -1.5,0; 2 0,0; 3 1.5,0
R0402 = smd 0.7 x 0.9: 1 -0.65,0; 2 0.65,0
0402-RES = smd 0.7 x 0.9: 1 -0.65,0; 2 0.65,0
RJ45-8 = drill 1 pad 1.88 square: 1 -4.445,6.35 | drill 1 pad 1.88: 2 -3.175,8.89; 3 -1.905,6.35; 4 -0.635,8.89; 5 0.635,6.35; 6 1.905,8.89; 7 3.175,6.35; 8 4.445,8.89 | hole 3.2: -5.715,0; 5.715,0
PBTH = drill 1.016 pad 1.676 octagon: 1 -0.001,0.001; 2 5.001,0.001
STAND-OFF = hole 3.302: 0,0
SOIC8 = smd 0.6 x 1.55: 1 -1.905,-2.7; 2 -0.635,-2.7; 3 0.635,-2.7; 4 1.905,-2.7; 5 1.905,2.7; 6 0.635,2.7; 7 -0.635,2.7; 8 -1.905,2.7
WSON12 = smd 0.25 x 0.6: CP 0.25,-1.9; EN 0.75,-1.9; GND 1.25,1.9; GND_CP 1.25,-1.9; IN1 -1.25,-1.9; IN2 -0.75,-1.9; IN_CP -0.25,-1.9; OUT1 -1.25,1.9; OUT2 -0.75,1.9; OUT_FB -0.25,1.9; SET 0.25,1.9; SET_FB 0.75,1.9 | smd 3 x 2.6: GPAD 0,0
PN80 = smd 1.35 x 0.3: 1 -6.825,4.75; 2 -6.825,4.25; 3 -6.825,3.75; 4 -6.825,3.25; 5 -6.825,2.75; 6 -6.825,2.25; 7 -6.825,1.75; 8 -6.825,1.25; 9 -6.825,0.75; 10 -6.825,0.25; 11 -6.825,-0.25; 12 -6.825,-0.75; 13 -6.825,-1.25; 14 -6.825,-1.75; 15 -6.825,-2.25; 16 -6.825,-2.75; 17 -6.825,-3.25; 18 -6.825,-3.75; 19 -6.825,-4.25; 20 -6.825,-4.75; 41 6.825,-4.75; 42 6.825,-4.25; 43 6.825,-3.75; 44 6.825,-3.25; 45 6.825,-2.75; 46 6.825,-2.25; 47 6.825,-1.75; 48 6.825,-1.25; 49 6.825,-0.75; 50 6.825,-0.25; 51 6.825,0.25; 52 6.825,0.75; 53 6.825,1.25; 54 6.825,1.75; 55 6.825,2.25; 56 6.825,2.75; 57 6.825,3.25; 58 6.825,3.75; 59 6.825,4.25; 60 6.825,4.75 | smd 0.3 x 1.35: 21 -4.75,-6.825; 22 -4.25,-6.825; 23 -3.75,-6.825; 24 -3.25,-6.825; 25 -2.75,-6.825; 26 -2.25,-6.825; 27 -1.75,-6.825; 28 -1.25,-6.825; 29 -0.75,-6.825; 30 -0.25,-6.825; 31 0.25,-6.825; 32 0.75,-6.825; 33 1.25,-6.825; 34 1.75,-6.825; 35 2.25,-6.825; 36 2.75,-6.825; 37 3.25,-6.825; 38 3.75,-6.825; 39 4.25,-6.825; 40 4.75,-6.825; 61 4.75,6.825; 62 4.25,6.825; 63 3.75,6.825; 64 3.25,6.825; 65 2.75,6.825; 66 2.25,6.825; 67 1.75,6.825; 68 1.25,6.825; 69 0.75,6.825; 70 0.25,6.825; 71 -0.25,6.825; 72 -0.75,6.825; 73 -1.25,6.825; 74 -1.75,6.825; 75 -2.25,6.825; 76 -2.75,6.825; 77 -3.25,6.825; 78 -3.75,6.825; 79 -4.25,6.825; 80 -4.75,6.825
ADS1231 = smd 0.6 x 1.55: AINN 4.445,-2.54; AINP 3.175,-2.54; AVDD -0.635,2.86; CAP1 0.635,-2.54; CAP2 1.905,-2.54; CLKIN -1.905,-2.54; DRDY/DOUT -4.445,2.86; DVDD -4.445,-2.54; GND1 -3.175,-2.54; GND2 1.905,2.86; PDWN -1.905,2.86; SCLK -3.175,2.86; SPEED -0.635,-2.54; SW 0.635,2.86; VREFN 4.445,2.86; VREFP 3.175,2.86
SOT95P280X145-6N = smd 1.27 x 0.559: 1 -1.295,0.94; 2 -1.295,0; 3 -1.295,-0.94; 4 1.295,-0.94; 5 1.295,0; 6 1.295,0.94

### Placement (x,y rotation side)
C1  72.09,36.22 90 top
C2  73.74,39.47 90 top
C4  25.6,30.08 180 top
C5  27.96,30.05 270 top
C6  72.14,39.47 90 top
C7  24.92,35.59 270 top
C8  71.09,23.75 0 top
C9  32.69,30.16 180 top
C10  70,40.48 90 top
C11  35.07,30.15 270 top
C12  31.88,35.59 270 top
C13  14.67,46.61 180 top
C14  15.75,35.05 90 top
C15  21.87,42.67 270 top
C16  62,24.23 270 top
C17  60.71,24.23 270 top
C18  55.99,21.45 180 top
C19  16.15,32.31 180 top
C20  18.61,46.84 90 top
C21  60.47,21.56 0 top
C22  18.34,35.14 270 top
C23  21.48,38.35 270 top
C24  53.18,35.11 90 top
C27  12.27,49.23 0 top
C28  7.14,51.31 180 top
C29  10.9,34.72 180 top
C30  10.67,32.87 0 top
C31  8.28,26.92 0 top
C32  10.67,31.04 180 top
C33  1.7,29.67 90 top
C34  12.24,51.1 0 top
C35  7.26,49.25 180 top
C36  6.77,34.77 180 top
C37  9.73,46.63 180 top
C402  61.96,15.42 0 top
C403  30.86,25.23 90 top
D3  21.69,26.64 0 top
G2  76.86,30.45 90 top
G3  76.86,35.43 90 top
J1  64.07,53.92 0 top
J3  10.9,-2.45 0 top
J401  58.65,1.45 90 top
JP1  23.72,21.08 180 top
JP2  40.77,21.39 180 top
JP3  18.4,55.83 180 top
LOGO1  69.88,3.78 0 bottom
Q2  65.91,21.3 180 top
R1  72.11,32.89 270 top
R2  64.8,2.4 90 top
R3  71.13,22.34 0 top
R4  57,18.9 90 top
R5  59.59,18.92 90 top
R6  45.92,17.17 90 top
R7  57,43.31 270 top
R8  58.32,43.33 270 top
R9  38.18,16.38 90 top
R11  28.76,38.34 180 top
R12  30.96,39.01 270 top
R13  35.99,38.38 180 top
R14  38.33,39.01 270 top
R15  15.37,26.87 0 top
R16  1.72,26.01 270 top
R24  76.68,32.28 180 top
R25  76.73,33.83 180 top
RS485_INPUT  26.56,3.48 0 top
RS485_OUTPUT  44.11,3.54 0 top
S1  78.74,25.88 180 top
S2  49.83,42.85 0 top
STANDOFF1  3,4 0 top
STANDOFF2  77,46 0 top
STANDOFF3  3,46 0 top
STANDOFF4  77,4 0 top
U1  50.13,27.15 90 top
U2  27.74,34.39 0 top
U3  63.01,34.03 180 top
U4  34.8,34.39 0 top
U5  15.13,40.74 180 top
U11  58.32,15.4 0 top
U$1  66.61,28.78 0 bottom

### Tracks (layer width: path | path; a pad name or v marks a point on that pad's centre or on a via)
ADC_PDWN  (via drill 0.33)
  Top 0.203: C19.1 21.21,32.31 23.75,34.85 23.75,37.87 26.82,40.95 40.16,40.95 40.97,40.13 40.97,33.1 v43.43,30.63 | v58.34,29.29 U3.60
  Top 0.584: U5.PDWN 17.04,32.33 C19.1
  Bottom 0.203: v43.43,30.63 57,30.63 v58.34,29.29
ADC_SCLK
  Top 0.203: U3.39 58.76,41.74 59.72,42.7 59.72,45.54 59.41,45.85 45.72,45.85 41.68,41.81 26.7,41.81 22.86,37.97 22.86,36.25 22.28,35.66 19.1,35.66 18.77,35.99 18.38,35.99 C22.1
  Top 0.584: U5.SCLK 18.28,36.09 C22.1
ADC_SOMI
  Top 0.203: U3.38 59.26,41.66 60.25,42.65 60.25,46.08 59.97,46.35 45.09,46.35 41.22,42.49 26.29,42.49 23.01,39.22 21.52,39.22 C23.1 20.95,39.25 U5.DRDY/DOUT
ADC_SPEED  (via drill 0.33)
  Top 0.203: U3.59 57.52,29.78 57.81,30.07 57.81,38.35 56.69,39.47 v49.2,39.47 | U5.SPEED 15.77,44.02 16.35,44.6 17.26,44.6 C20.1 42.75,45.94
  Top 0.305: 42.75,45.94 v42.76,45.93
  Bottom 0.203: v42.76,45.93 42.81,45.91 v49.2,39.47
AVCC
  Top 0.203: U3.11 72.08,34.28 72.08,34.29 | 72.08,34.29 72.08,33.57 R1.1 | 72.08,34.29 C1.1
BARREL_JACK
  Top 1.067: JP1.6 12.06,19.81 10.87,18.62 10.87,11.28 J3.PWR
GND  (via drill 0.33)
  Top 0.203: G3.C 75.98,37.02 | U3.49 55.01,34.78 54.03,35.76 C24.2 | C24.2 | C24.2 51.97,35.76 v51.49,36.25 | R8.1 58.32,45.01 v58.17,45.16 | U3.68 v61.76,29.3 v61.75,29.31 | U3.14 69.85,35.76 71.04,35.76 71.75,36.87 C1.2 73.34,36.87 v73.36,36.88 | v73.71,41.76 73.72,41.74 73.72,40.11 C2.2 73.72,40.11 72.09,40.11 | U3.19 70.72,38.28 71.02,38.58 71.02,39.73 71.32,40.03 72.01,40.03 72.09,40.11 | C10.2 70,42.65 v70.03,42.67 | C6.2 72.1,40.12 72.09,40.11 | 9.75,32.89 9.81,32.89 C30.1
  Top 0.305: U3.61 arc45 58.16,27.16 v57.34,26.34 | R14.1 39.44,39.66 v39.45,39.67 | U4.GND_CP 36.71,32.49 v36.85,32.51 | U2.GND_CP 28.99,32.08 v29.49,31.62 | C5.2 v27.96,28.25 | C4.2 v23.57,30.08 v23.57,30.07 | D3.A 17.86,26.64 v17.83,26.67 | C19.2 15.25,31 v15.24,30.99 | C14.1 14.34,34.4 v14.33,34.42 | C22.2 19.61,34.24 v19.63,34.27 | C23.2 20.97,37.45 v20.34,36.52 | U5.GND2 13.22,36.19 v13.21,36.17 | C36.2 v5.92,33.28 v5.92,33.27 | C33.2 3.06,30.57 v3.07,30.58 | R16.2 2.8,25.36 v3.17,24.99 | C7.2 24.26,33.83 v24.16,33.63 | C9.2 v32.04,28.99 v32.03,28.98 | C11.2 35.07,28.43 v35.1,28.4 | C12.2 v31.88,33.63 | C403.- v30.86,21.65 v30.86,21.64 | C20.2 v18.61,48.98 | C27.2 v14.48,49.23 | C34.2 v14.48,51.1 | C32.2 9.77,30.21 v9.25,29.69 | Q2.2 65.91,19.4 v65.86,19.36 | C402.2 64.24,15.42 v64.26,15.44 | U11.2 55.46,15.4 v55.45,15.42 | C18.2 55.14,20.11 v55.09,20.07 | C21.2 61.32,21.05 v62.23,20.14 | v63.45,23.55 63.41,23.58 C16.2 C17.2 | C8.2 71.96,23.75 v73.08,22.63 | G2.C 74.75,30.45 v74.73,30.43 | 75.98,37.02 v75.97,37.03 | U1.4 52.81,29.62 v52.86,29.95 | R12.1 32.17,39.66 v32.18,39.65 | U2.GND v29.86,36.29 v29.87,36.3 | U4.GND v36.9,36.29 v36.91,36.3 | C28.2 v5.18,51.31 | C35.2 5.66,49.25 v5.13,49.78 | 8.81,32.89 v8.66,32.89 9.75,32.89 9.78,32.92 | C15.2 v21.87,40.95
  Top 0.584: U4.GPAD v36.93,34.39 | U2.GPAD 27.03,34.39 v25.6,32.97 | R2.2 64.8,4.49 v64.75,4.55 | J401.GND 57.35,4.98 v56.49,5.84 | U5.GND1 18.3,41.99 v18.77,41.53 | U5.CLKIN 17.04,41.85 v16.76,41.58
  pour Route15: 0,60 30,60 30,24 0,24
  pour Route15: 31,60 31,24 53,24 53,14 80,14 80,60
  pour Route15: 0,23 0,0 80,0 80,13 53,13 53,23
  pour Route15: 8,26 18,26 18,21 8,21
  pour Route15: 31,26 31,14 57,14 57,26
LOAD_GND
  Top 0.584: JP3.2 14.9,57.09 13.84,58.14 5.84,58.14 4.19,56.49 4.19,49.38 6.53,47.04 6.53,40.59 7.77,39.34 13.74,39.34 14.48,38.61 14.48,37.9 U5.SW
LOAD_N
  Top 0.584: U5.AINN 8.13,45.84 C37.2 8.13,49.24 C35.1 8.11,51.23 C28.1 8.04,55.69 JP3.4
LOAD_P
  Top 0.584: U5.AINP 11.94,43.3 11.94,45.01 11.23,45.72 11.23,46.46 11.33,46.56 C37.1 11.33,49.13 C27.1 11.42,51.03 C34.1 11.4,51.16 JP3.3
N$1
  Top 0.305: JP2.2 43.63,20.12 R6.2
N$3  (via drill 0.6)
  Top 0.305: R6.1 45.92,12.52 RS485_OUTPUT.6 | U1.7 49.05,26.51 v49.17,26.39
  Bottom 0.305: RS485_INPUT.2 23.39,12.38 23.39,14.83 23.75,15.19 45.62,15.19 46.02,14.79 RS485_OUTPUT.6 49.17,15.59 v49.17,26.39
N$4  (via drill 0.6)
  Top 0.305: R9.1 38.18,11.38 RS485_OUTPUT.1 | U1.6 50.17,27.78 v50.29,27.46
  Bottom 0.305: RS485_INPUT.3 24.66,8.29 25.15,7.8 39.24,7.8 39.67,8.23 39.67,9.88 RS485_OUTPUT.1 40.98,11.18 49.43,11.18 50.29,11.96 v50.29,27.46
N$5
  Top 0.305: RS485_OUTPUT.3 42.2,9.66 | U1.8 51.79,20.89 51.79,11.15 48.59,8.15 48.56,8.15 47.45,7.04 43.26,7.04 42.22,8.08 42.22,9.88 RS485_OUTPUT.3 | JP2.1 43.31,22.53 42.04,21.26 42.04,18.69 44.73,15.95 44.73,11.76 46.02,10.52 46.02,10.01 | 46.02,10.01 46,9.98 | 46.02,10.01 46.02,8.61 45.49,8.08 44.02,8.08 RS485_OUTPUT.3
  Bottom 0.305: RS485_OUTPUT.3 42.05,9.89 41.17,9.02 41.17,7.8 40.23,6.86 22.99,6.86 22,7.85 22,9.71 RS485_INPUT.1
N$6
  Top 0.203: R25.1 77.38,35.08 G3.A
N$7
  Top 0.305: R9.2 38.18,20.07 JP2.6
N$8  (via drill 0.6)
  Top 0.305: JP2.5 38.63,22.66 39.5,21.79 39.5,13.87 RS485_OUTPUT.2 | U1.5 45.27,29.05 v45.24,29.08
  Bottom 0.305: RS485_INPUT.6 28.46,13.88 28.73,14.15 40.66,14.15 40.95,13.87 RS485_OUTPUT.2 | v45.24,29.08 38.76,29.08 38.23,28.55 JP2.5
N$9
  Top 0.203: U4.SET 35.05,38.09 R13.2
N$10
  Top 0.305: U11.3 57.02,8.11 58.65,6.48 J401.D+
N$11
  Top 0.203: U2.SET_FB 28.49,36.89 28.78,37.19 29.21,37.19 29.46,37.44 29.46,38.28 R11.1 30.93,38.34 R12.2
N$12
  Top 0.203: U2.SET 27.99,38.21 R11.2
N$13
  Top 0.305: C5.1 27.96,32.47 U2.CP
N$14
  Top 0.305: U11.4 59.61,7.85 59.31,7.54 59.31,4.13 J401.D-
N$15
  Top 0.203: U4.SET_FB 35.55,37 35.74,37.19 36.35,37.19 36.65,37.49 36.65,38.37 R13.1 38.12,38.38 R14.2
N$16
  Top 0.203: C11.1 35.07,32.56 U4.CP
N$17
  Top 0.584: U5.CAP1 14.49,44.83 C13.1
N$18
  Top 0.584: U5.CAP2 13.22,46.45 C13.2
N$19
  Top 0.203: R24.1 77.33,30.86 G2.A
N$20
  Top 0.584: R2.1 64.5,1.45 J401.SHIELD2 61.75,2.45 J401.SHIELD4 59.5,1.55 J401.SHIELD6 59.45,1.4 57.94,1.4 57.88,1.45 J401.SHIELD5 J401.SHIELD1 55.55,2.45 J401.SHIELD3
N$32
  Top 0.584: 11.8,27.27 C31.A | C31.A 14.67,26.92 R15.1 | C31.A 11.57,27.04 C32.1 11.53,31.31 C30.2 11.55,32.92 C29.1 11.96,35.13 U5.VREFP
N$38
  Top 0.203: S2.2 54.83,43.1 55.68,43.94 56.98,43.94 R7.1
N$42
  Top 0.203: U11.6 59.61,18.25
  Top 0.305: 59.61,18.25 R5.1
N$43
  Top 0.203: U11.1 57.02,18.23
  Top 0.305: 57.02,18.23 R4.1
N$78
  Top 0.584: U5.VREFN 10.66,35.13 C29.2 7.93,34.72 C36.1 7.62,29.69 C31.C 1.98,26.92 R16.1 1.72,28.75 C33.1
N$89
  Top 1.067: 43.54,12.49 RS485_OUTPUT.4 | RS485_OUTPUT.5 44.74,10.42 43.64,11.53 43.64,12.27 RS485_OUTPUT.4 | 43.31,12.6 RS485_OUTPUT.4 | JP2.4 40.77,17.93 43.26,15.44 43.26,12.65 RS485_OUTPUT.4
NETWORK_LED
  Top 0.203: U3.4 71.95,30.78 74.91,33.73 75.98,33.73 | 76.05,33.71 76.02,33.73 75.98,33.73 | 75.98,33.73 R25.2
P5.2/XT2IN
  Top 0.203: U3.69 62.26,26.21 63.27,25.2 64.06,25.2 64.34,24.92 64.34,21.36 Q2.3
P5.3/XT2OUT
  Top 0.203: U3.70 62.76,26.42 63.2,25.98 64.19,25.98 64.95,25.22 64.95,23.7 65.38,23.27 67.03,23.27 67.39,22.91 67.39,21.32 Q2.1
POWER_SELECTION
  Top 0.203: U2.EN 28.49,31.89 28.8,31.57 28.8,26.67 28.78,26.64 | U4.EN 35.55,31.94 35.89,31.6 35.89,26.75 35.99,26.64
  Top 0.305: 33.56,30.36 C9.1 | U4.IN_CP U4.IN1 | 26.49,30.32 C4.1 | U2.IN_CP U2.IN1
  Top 0.584: C4.1 26.25,26.66 26.26,26.64 | C9.1 33.34,26.84 33.53,26.64 | C403.+ 31.21,26.59 31.27,26.64
  Top 0.61: U4.IN1 33.56,30.36 | U4.IN2 34.06,30.86 C9.1 | U2.IN1 26.49,30.32 | U2.IN2 26.99,30.82 C4.1
  Top 1.067: JP1.3 23.7,22.38 23.7,26.5 D3.C 26.26,26.64 28.78,26.64 31.27,26.64 33.53,26.64 35.99,26.64 40.18,26.64 40.77,26.06 JP2.3 | JP1.5 JP1.3 | JP1.3 JP1.1
RS485_RX
  Top 0.203: U1.2 53.56,26.51 54.33,27.28 54.33,32.66 54.97,33.3 56.16,33.3 U3.52
RS485_TX
  Top 0.203: U1.3 52.05,27.78 50.67,29.16 50.67,33.45 51,33.78 U3.51
RS485_VBUS
  Top 1.067: JP1.4 23.95,19.58 23.95,16.74 25.93,14.77 RS485_INPUT.4 25.88,12.33 25.88,11.71 27.2,10.4 RS485_INPUT.5
RST/SBWTDIO
  Top 0.203: 70.48,24.32 C8.1 70.48,23.71 R3.1 | S1.2 72.05,25.88 70.48,24.32 | 70.48,24.32 66.87,24.32 65.73,25.45 65.73,27.18 U3.76 65.81,27.26 65.81,28.19 68.17,30.56 68.17,39.47 69.15,40.4 J1.11
SENSOR_LED
  Top 0.203: U3.3 72.72,30.28 74.73,32.28 R24.2
TARGET_PUR
  Top 0.152: 59.24,27.19 U3.63
  Top 0.203: U3.63 59.26,37.47 56.92,39.8 56.92,42.18 R7.2 58.3,42.66 R8.2
TARGET_VUSB
  Top 0.203: U3.66 60.76,24.93 C17.1
TCK  (via drill 0.33)
  Top 0.203: U3.75 65.26,28.2 66.24,29.18 66.24,36.68 v66.27,36.7
  Bottom 0.203: 66.22,36.65 v66.27,36.7 66.27,39.78 64.03,42.01 64.03,52.62 J1.7
TDI  (via drill 0.33)
  Top 0.203: U3.73 64.26,28.5 64.85,29.08 v64.85,32.82
  Bottom 0.203: 64.8,32.77 v64.85,32.82 58.99,38.67 J1.3
TDO  (via drill 0.33)
  Top 0.203: U3.72 63.76,28.71 64.21,29.16 64.21,31.09 v64.16,31.14
  Bottom 0.203: 64.11,31.09 v64.16,31.14 56.45,38.85 J1.1
TEST/SBWTCK  (via drill 0.33)
  Top 0.203: U3.71 63.26,29.25 v63.25,29.26
  Bottom 0.203: 63.22,29.23 v63.25,29.26 64.08,29.26 67.23,32.41 67.23,47.4 65.33,49.3 65.33,53.94 J1.8
TMS  (via drill 0.33)
  Top 0.152: 64.77,27.2 U3.74
  Top 0.203: 64.77,27.2 64.77,28.37 65.53,29.13 65.53,34.67 v65.51,34.7
  Bottom 0.203: 65.56,34.65 v65.51,34.7 65.51,35.18 61.52,39.17 61.52,52.64 J1.5
USB_DM
  Top 0.152: 59.77,27.2 U3.64
  Top 0.203: R5.2 59.59,21.53 C21.1 59.62,25.56 59.82,25.76 59.82,27.15 U3.64
USB_DP
  Top 0.152: 58.77,27.2 U3.62
  Top 0.203: R4.2 57,21.29 C18.1 56.84,23.69 58.73,25.58 58.73,27.17 U3.62
USB_VBUS  (via drill 0.33, 0.58)
  Top 0.152: 60.27,27.2 U3.65
  Top 0.203: v60.17,29.16 60.17,27.29 U3.65 | 61.21,15.4 61.29,15.4 C402.1
  Top 0.305: 61.21,15.4 U11.5 61.25,15.4 61.32,15.34 61.32,7.26 v60.66,6.6 | C402.1 61.31,16.83 v61.34,16.87
  Top 0.584: 36.7,6.04 48.31,6.04 v49.78,7.52 | v60.66,6.6 60.66,5.84 59.97,5.16 59.97,4.14 J401.VBUS
  Top 0.61: 36.7,6.04 35.31,7.44 35.31,18.69 34.16,19.84 26.29,19.84 JP1.2
  Bottom 0.203: 60.2,24.31 60.2,29.13 | v60.17,29.16 60.17,32.23 S2.1
  Bottom 0.305: v61.34,16.87 61.34,23.16 60.2,24.31 | 60.2,29.13 v60.17,29.16
  Bottom 0.584: v49.78,7.52 59.74,7.52 v60.66,6.6
V18
  Top 0.203: U3.67 61.26,26.35 61.92,25.68 61.92,24.96 C16.1
VCC  (via drill 0.33)
  Top 0.203: U3.50 53.36,34.28 | 53.36,34.28 C24.1 | 53.36,34.28 51.55,34.28 v50.93,34.9 | R1.2 72.45,32.24 v73.23,33.02 | U3.18 71.06,37.78 72.1,38.82 C6.1 C2.1 75.09,38.82 v75.11,38.84 | 19.62,43.32 C15.1
  Top 0.305: U1.1 v54.81,25.24 v54.81,25.25 | U4.OUT_FB U4.OUT2 U4.OUT1 33.49,36.23 C12.1 | C15.1 v32.27,43.32 v32.28,43.33
  Top 0.584: 19.62,43.32 U5.DVDD | R3.2 71.78,21.16 v71.81,21.13 | C12.1 31.88,36.93 v32.44,37.49
  pour Route2: 31,60 31,24 53,24 53,14 80,14 80,60
VCC_5V  (via drill 0.33)
  Top 0.305: 15.77,35.72 15.13,35.72 v14.63,36.22 | C7.1 24.97,36.29 U2.OUT1 U2.OUT2 U2.OUT_FB
  Top 0.584: U5.AVDD 15.77,35.72 C14.2 | R15.2 16.02,25.62 v15.98,25.58 | C7.1 24.92,37.03 v25.4,37.52
  pour Route2: 0,60 30,60 30,24 0,24
VCORE
  Top 0.203: U3.20 70.05,39 70.05,39.78 C10.1